# Altium schematic sheet Control-MCU.SchDoc
size A3
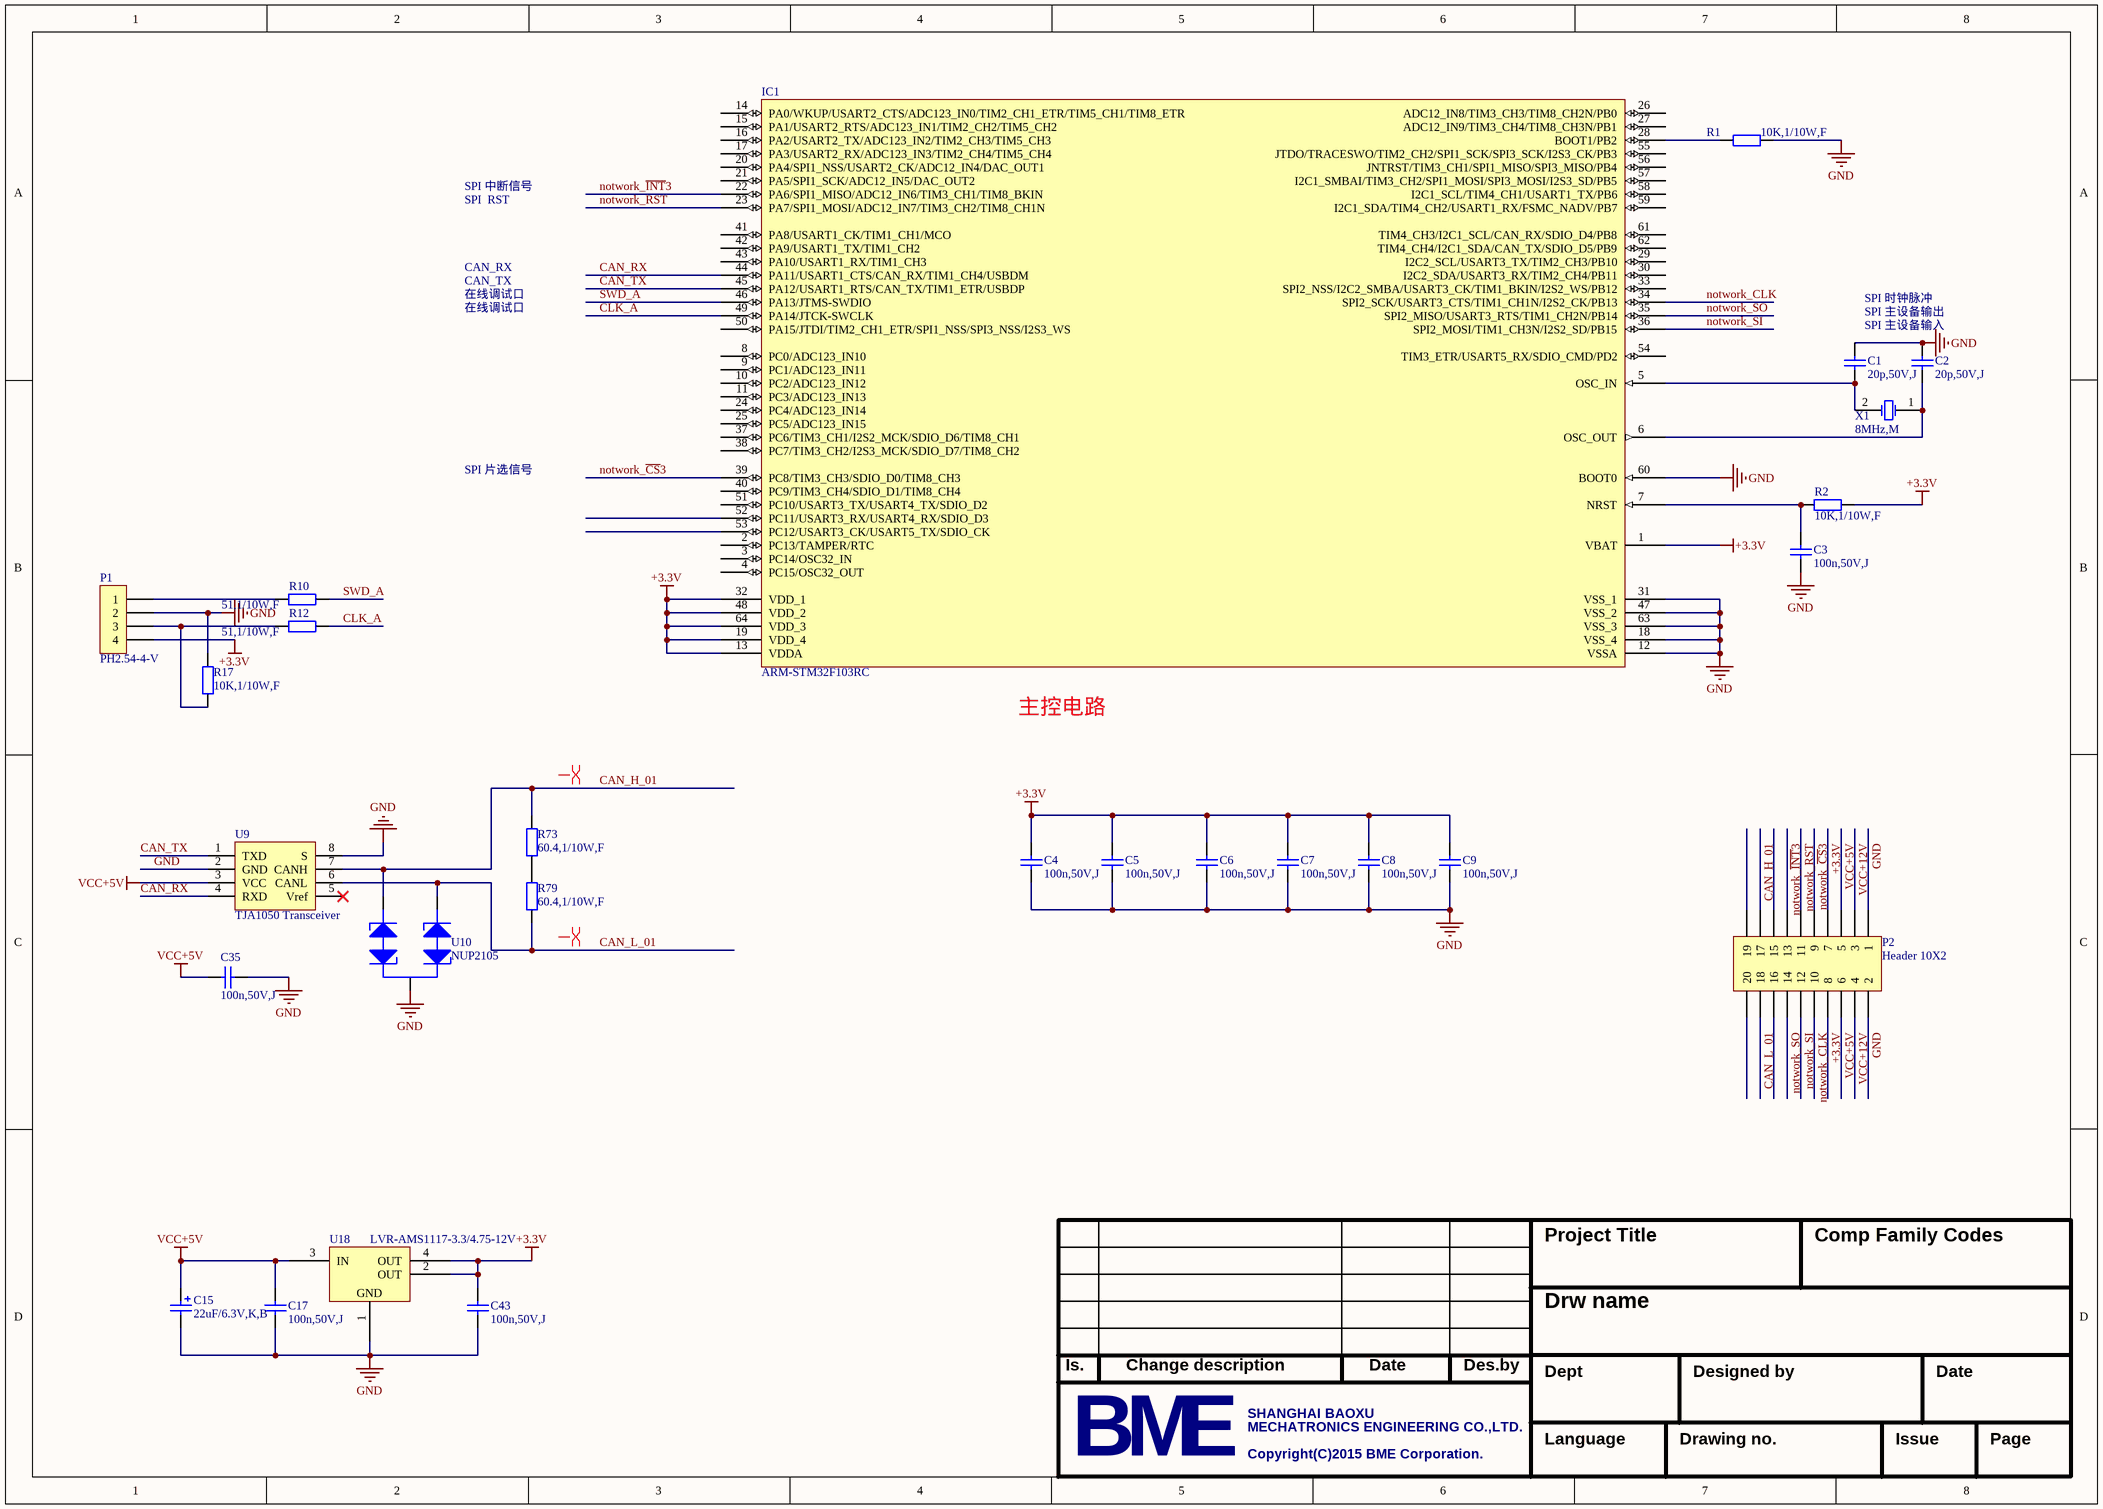
[diagram p0: Control-MCU.SchDoc]

## Parts
C1  20p,50V,J  [C0603]
C2  20p,50V,J  [C0603]
C3  100n,50V,J  [C0603]
C4  100n,50V,J  [C0603]
C5  100n,50V,J  [C0603]
C6  100n,50V,J  [C0603]
C7  100n,50V,J  [C0603]
C8  100n,50V,J  [C0603]
C9  100n,50V,J  [C0603]
C15  22uF/6.3V,K,B  [3528B]
C17  100n,50V,J  [C0603]
C35  100n,50V,J  [C0603]
C43  100n,50V,J  [C0603]
IC1  ARM-STM32F103RC  [LQFP-64]
P1  PH2.54-4-V  [SIP4]
P2  Header 10X2  [805-1]
R1  10K,1/10W,F  [R0603]
R2  10K,1/10W,F  [R0603]
R10  51,1/10W,F  [R0603]
R12  51,1/10W,F  [R0603]
R17  10K,1/10W,F  [R0603]
R73  60.4,1/10W,F  [R0603]
R79  60.4,1/10W,F  [R0603]
U9  TJA1050 Transceiver  [SOP-8]
U10  NUP2105  [SOT-23P]
U18  LVR-AMS1117-3.3/4.75-12V  [SOT-223]
X1  8MHz,M  [X5032]

## Nets
+3.3V: C4.2 C5.2 C6.2 C7.2 C8.2 C9.2 C43.1 IC1.1(VBAT) IC1.13(VDDA) IC1.19(VDD_4) IC1.32(VDD_1) IC1.48(VDD_2) IC1.64(VDD_3) P1.4 P2.7 P2.8 R2.1 U18.2(OUT) U18.4(OUT)
GND: C1.2 C2.2 C3.1 C4.1 C5.1 C6.1 C7.1 C8.1 C9.1 C15.2 C17.2 C35.1 C43.2 IC1.12(VSSA) IC1.18(VSS_4) IC1.31(VSS_1) IC1.47(VSS_2) IC1.60(BOOT0) IC1.63(VSS_3) P1.2 P2.1 P2.2 R1.1 R17.1 U9.2(GND) U9.8(S) U10.3 U18.1(GND)
VCC+5V: C15.1 C17.1 C35.2 P2.5 P2.6 U9.3(VCC) U18.3(IN)
CAN_H_01: P2.17 R73.2 U9.7(CANH) U10.1
CAN_L_01: P2.18 R79.1 U9.6(CANL) U10.2
CAN_RX: IC1.44(PA11/USART1_CTS/CAN_RX/TIM1_CH4/USBDM) U9.4(RXD)
CAN_TX: IC1.45(PA12/USART1_RTS/CAN_TX/TIM1_ETR/USBDP) U9.1(TXD)
CLK_A: IC1.49(PA14/JTCK-SWCLK) R12.2
notwork_~{CS}3: IC1.39(PC8/TIM3_CH3/SDIO_D0/TIM8_CH3) P2.9
notwork_CLK: IC1.34(SPI2_SCK/USART3_CTS/TIM1_CH1N/I2S2_CK/PB13) P2.10
notwork_~{INT}3: IC1.22(PA6/SPI1_MISO/ADC12_IN6/TIM3_CH1/TIM8_BKIN) P2.13
notwork_RST: IC1.23(PA7/SPI1_MOSI/ADC12_IN7/TIM3_CH2/TIM8_CH1N) P2.11
notwork_SI: IC1.36(SPI2_MOSI/TIM1_CH3N/I2S2_SD/PB15) P2.12
notwork_SO: IC1.35(SPI2_MISO/USART3_RTS/TIM1_CH2N/PB14) P2.14
SWD_A: IC1.46(PA13/JTMS-SWDIO) R10.2
VCC+12V: P2.3 P2.4
NetC1_1: C1.1 IC1.5(OSC_IN) X1.2(OSC2)
NetC2_1: C2.1 IC1.6(OSC_OUT) X1.1(OSC1)
NetC3_2: C3.2 IC1.7(NRST) R2.2
NetIC1_28: IC1.28(BOOT1/PB2) R1.2
NetP1_1: P1.1 R10.1
NetP1_3: P1.3 R12.1 R17.2
NetR73_1: R73.1 R79.2

Not connected (* = marked no-connect by the designer): IC1 2(PC13/TAMPER/RTC) 3(PC14/OSC32_IN) 4(PC15/OSC32_OUT) 8(PC0/ADC123_IN10) 9(PC1/ADC123_IN11) 10(PC2/ADC123_IN12) 11(PC3/ADC123_IN13) 14(PA0/WKUP/USART2_CTS/ADC123_IN0/TIM2_CH1_ETR/TIM5_CH1/TIM8_ETR) 15(PA1/USART2_RTS/ADC123_IN1/TIM2_CH2/TIM5_CH2) 16(PA2/USART2_TX/ADC123_IN2/TIM2_CH3/TIM5_CH3) 17(PA3/USART2_RX/ADC123_IN3/TIM2_CH4/TIM5_CH4) 20(PA4/SPI1_NSS/USART2_CK/ADC12_IN4/DAC_OUT1) 21(PA5/SPI1_SCK/ADC12_IN5/DAC_OUT2) 24(PC4/ADC123_IN14) 25(PC5/ADC123_IN15) 26(ADC12_IN8/TIM3_CH3/TIM8_CH2N/PB0) 27(ADC12_IN9/TIM3_CH4/TIM8_CH3N/PB1) 29(I2C2_SCL/USART3_TX/TIM2_CH3/PB10) 30(I2C2_SDA/USART3_RX/TIM2_CH4/PB11) 33(SPI2_NSS/I2C2_SMBA/USART3_CK/TIM1_BKIN/I2S2_WS/PB12) 37(PC6/TIM3_CH1/I2S2_MCK/SDIO_D6/TIM8_CH1) 38(PC7/TIM3_CH2/I2S3_MCK/SDIO_D7/TIM8_CH2) 40(PC9/TIM3_CH4/SDIO_D1/TIM8_CH4) 41(PA8/USART1_CK/TIM1_CH1/MCO) 42(PA9/USART1_TX/TIM1_CH2) 43(PA10/USART1_RX/TIM1_CH3) 50(PA15/JTDI/TIM2_CH1_ETR/SPI1_NSS/SPI3_NSS/I2S3_WS) 51(PC10/USART3_TX/USART4_TX/SDIO_D2) 52(PC11/USART3_RX/USART4_RX/SDIO_D3) 53(PC12/USART3_CK/USART5_TX/SDIO_CK) 54(TIM3_ETR/USART5_RX/SDIO_CMD/PD2) 55(JTDO/TRACESWO/TIM2_CH2/SPI1_SCK/SPI3_SCK/I2S3_CK/PB3) 56(JNTRST/TIM3_CH1/SPI1_MISO/SPI3_MISO/PB4) 57(I2C1_SMBAI/TIM3_CH2/SPI1_MOSI/SPI3_MOSI/I2S3_SD/PB5) 58(I2C1_SCL/TIM4_CH1/USART1_TX/PB6) 59(I2C1_SDA/TIM4_CH2/USART1_RX/FSMC_NADV/PB7) 61(TIM4_CH3/I2C1_SCL/CAN_RX/SDIO_D4/PB8) 62(TIM4_CH4/I2C1_SDA/CAN_TX/SDIO_D5/PB9); P2 15 16 19 20; U9 5(Vref)*

## Layout directives
differential pair: (no net found under the mark)

## Notes on the sheet
- SPI 中断信号
- SPI  RST
- 在线调试口
- CAN_TX
- CAN_RX
- SPI 时钟脉冲
- SPI 主设备输出
- SPI 主设备输入
- SPI 片选信号
- (near IC1) 主控电路
- Project Title
- Comp Family Codes
- Drw name
- Is.
- Change description
- Date
- Des.by
- Dept
- Designed by
- Copyright(C)2015 BME Corporation.
- SHANGHAI BAOXU
- MECHATRONICS ENGINEERING CO.,LTD.
- Language
- Drawing no.
- Issue
- Page
- B
- M
- E

## Library data of the parts
C1 C2 = 30602019: Manufactuer: 三星; Manufactuer P/N: CL10B200JB8NNNC; 封装: 0603; Name: 贴片电容; Part Number: 30602019; helpURL: 306\30601\UNIOHM CHIP SERIES.pdf; Price: 0.003; Supplier: 友进芯城
C3-C9 C17 C35 C43 = 30602059: Manufactuer: 三星; Manufactuer P/N: CL10B104JB8NNNC; 封装: 0603; Name: 贴片电容; Part Number: 30602059; helpURL: 306\30601\UNIOHM CHIP SERIES.pdf; Price: 0.003; Supplier: 友进芯城
C15 = 30603403: Manufactuer: AVX; Manufactuer P/N: TAJB226M006RNJ; Name: 贴片钽电容; HelpURL: *; Part Number: 30603403; Price: 2.35; Supplier: 友进芯城; 封装: 3528B
IC1 = 30613205: Manufactuer: ST; Name: 微处理器类; 封装: LQFP64; HelpURL: *; Part Number: 30613205; Supplier: 友进芯城
P1 = 30609103: Manufactuer: 国产; Manufactuer P/N: WJ15EDGVC3.81-4P; Name: 连接器; 封装: PH2.54-4V; HelpURL: *; Part Number: 30609103; Supplier: 友进芯城
P2 = Header 10X2: Header, 10-Pin, Dual row; LatestRevisionDate: 17-Jul-2002; LatestRevisionNote: Re-released for DXP Platform.; Publisher: Altium Limited
R1 R2 R17 = 30601099: Manufactuer: 厚声; Manufactuer P/N: 0603 F1002T5E; 封装: 0603; Name: 贴片电阻; Part Number: 30601099; helpURL: 306\30601\UNIOHM CHIP SERIES.pdf; Price: 0.03; Supplier: 友进芯城
R10 R12 = 30601043: Manufactuer: 厚声; Manufactuer P/N: 0603WAF510JT5E; 封装: 0603; Name: 贴片电阻; Part Number: 30601043; helpURL: 306\30601\UNIOHM CHIP SERIES.pdf; Price: 0.03; Supplier: 友进芯城
R73 R79 = 30601045: Manufactuer: 厚声; Manufactuer P/N: 0603WAF604JT5E; 封装: 0603; Name: 贴片电阻; Part Number: 30601045; helpURL: 306\30601\UNIOHM CHIP SERIES.pdf; Price: 0.03; Supplier: 友进芯城
U9 = 30613501: Manufactuer: NXP; Name: 通讯芯片; HelpURL: *; Manufactuer P/N: *; Part Number: 30613501; Supplier: 友进芯城; 封装: SOP-8
U10 = 30613517: Manufactuer: NXP; Name: 通讯芯片; HelpURL: *; Manufactuer P/N: *; Part Number: 30613517; Supplier: 友进芯城; 封装: SOT-23P
U18 = 30614001: Manufactuer: AMS; Name: 电源芯片; HelpURL: *; Manufactuer P/N: *; Part Number: 30614001; Supplier: 友进芯城; 封装: SOT-223
X1 = 30612002: Manufactuer: LC; Name: 晶振; 封装: 5032; HelpURL: *; Part Number: 30612002; Supplier: 友进芯城; Price: 1.44